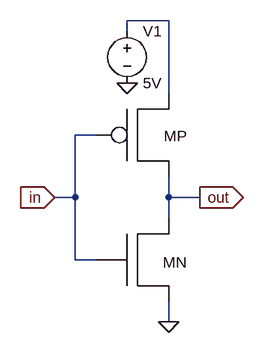
[diagram p0: schematic NOT.asc]
NOT.asc, the LTspice schematic file:
Version 4
SHEET 1 880 680
WIRE 512 -96 448 -96
WIRE 448 -80 448 -96
WIRE 512 16 512 -96
WIRE 400 80 368 80
WIRE 368 176 368 80
WIRE 368 176 336 176
WIRE 512 176 512 144
WIRE 560 176 512 176
WIRE 512 208 512 176
WIRE 368 272 368 176
WIRE 400 272 368 272
WIRE 512 368 512 336
FLAG 336 176 in
IOPIN 336 176 In
FLAG 560 176 out
IOPIN 560 176 Out
FLAG 512 368 0
FLAG 448 0 0
SYMBOL NMOSX 480 256 R0
SYMATTR InstName MN
SYMBOL PMOSX 480 64 R0
SYMATTR InstName MP
SYMBOL voltage 448 -96 R0
SYMATTR InstName V1
SYMATTR Value 5V

The netlist it stands for:
* NOT.asc
XMN out in 0 NMOSX  ; pins D G S
XMP out in N001 PMOSX  ; pins D G S
V1 N001 0 5V
.backanno
.end